# EAGLE design arm_femur_wLED_stemma (EAGLE 7.3.0)
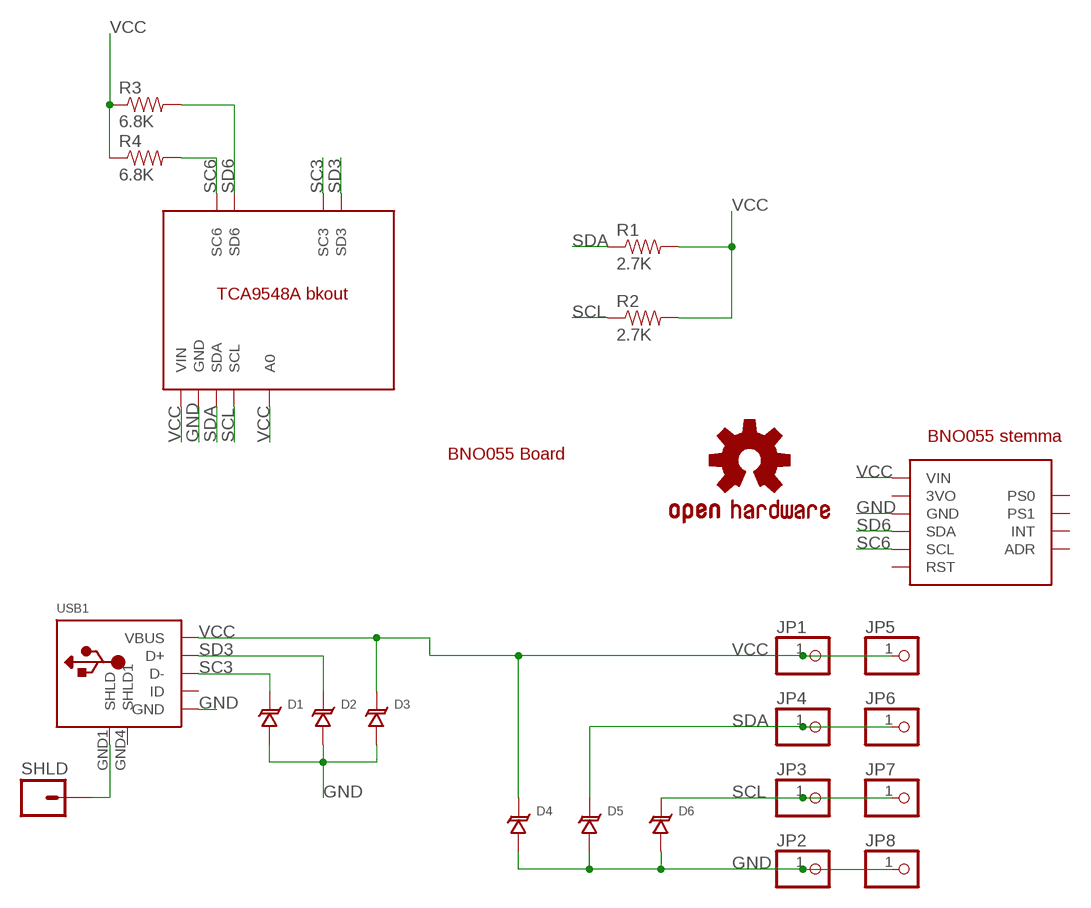
[diagram p0: schematic, sheet 1]

## Parts
D1  TVS_DIODE_SOD723  [SOD723]
D2  TVS_DIODE_SOD723  [SOD723]
D3  TVS_DIODE_SOD723  [SOD723]
D4  TVS_DIODE_SOD723  [SOD723]
D5  TVS_DIODE_SOD723  [SOD723]
D6  TVS_DIODE_SOD723  [SOD723]
JP1  PINHD-1X1CB  [1X01-CLEANBIG]
JP2  PINHD-1X1CB  [1X01-CLEANBIG]
JP3  PINHD-1X1CB  [1X01-CLEANBIG]
JP4  PINHD-1X1CB  [1X01-CLEANBIG]
JP5  PINHD-1X1CB  [1X01-CLEANBIG]
JP6  PINHD-1X1CB  [1X01-CLEANBIG]
JP7  PINHD-1X1CB  [1X01-CLEANBIG]
JP8  PINHD-1X1CB  [1X01-CLEANBIG]
LOGO1  OSHW-LOGOM  [OSHW-LOGO-M]
R1  2.7K  RESISTORAXIAL-0.3  [AXIAL-0.3]
R2  2.7K  RESISTORAXIAL-0.3  [AXIAL-0.3]
R3  6.8K  RESISTORAXIAL-0.3  [AXIAL-0.3]
R4  6.8K  RESISTORAXIAL-0.3  [AXIAL-0.3]
SHLD  M01PTH  [1X01]
U$2  TCA9548_ARM_FEMUR  [TCA9548_ARM_FEMUR]
U$3  BNO_055_STEMMA  [BNO_STEMMA]
USB1  USB  [USB-MINIB-THM-MOLEX_NOSLK]

## Nets
GND: D1.A D2.A D3.A D4.A D5.A D6.A JP2.1 JP8.1 U$2.GND U$3.GND USB1.GND
N$4: SHLD.1 USB1.GND1(SHLD)
SC3: D1.C U$2.SC3 USB1.D-
SC6: R4.P$2 U$2.SC6 U$3.SCL
SCL: D6.C JP3.1 JP7.1 R2.P$1 U$2.SCL
SD3: D2.C U$2.SD3 USB1.D+
SD6: R3.P$2 U$2.SD6 U$3.SDA
SDA: D5.C JP4.1 JP6.1 R1.P$1 U$2.SDA
VCC: D3.C D4.C JP1.1 JP5.1 R1.P$2 R2.P$2 R3.P$1 R4.P$1 U$2.A0 U$2.VIN U$3.VIN USB1.VBUS
Unconnected: U$3.3VO U$3.ADR U$3.INT U$3.PS0 U$3.PS1 U$3.RST USB1.GND4(SHLD1) USB1.ID

## Notes on the sheet
- BNO055 stemma
- BNO055 Board

## Library data of the parts
D1-D6 = little_fuse_tvs:TVS_DIODE_SOD723
JP1-JP8 = adafruit:PINHD-1X1: Pin header 1x1 for 0.1" spacing With round pins
LOGO1 = SparkFun-Aesthetics:OSHW-LOGO: Open Source Hardware Logo This logo indicates the piece of hardware it is found on incorporates a OSHW license and/or adheres to the definition of open source hardware found here: http://freedomdefined.org/OSHW
R1-R4 = SparkFun-Passives:RESISTOR: Resistor Basic schematic elements and footprints for 0603, 1206, and PTH resistors.
SHLD = SparkFun-Connectors:M01: Header 1 Standard 1-pin 0.1" header. Use with straight break away headers (SKU : PRT-00116), right angle break away headers (PRT-00553), swiss pins (PRT-00743), machine pins (PRT-00117), and female headers (PRT-00115). SMTSO-256-ET is a "flush mount" nut for a 4-40 screw. The older package used to be too tight, and did not allow it to sit properly thru the drill hit. The latest (0.165DIA) fits nice and snug.
U$2 = skeleton:TCA9548_ARM_FEMUR
U$3 = skeleton:BNO_055_STEMMA
USB1 = adafruit:USB: USB Connectors USBMINIB - Surface Mount Female Mini-B USB Connector 4UConnector: 06564 By microbuilder.eu Thru-hole RA Female Mini-B USB Connector 4UConnector: 18732 By ladyada.net

## Board
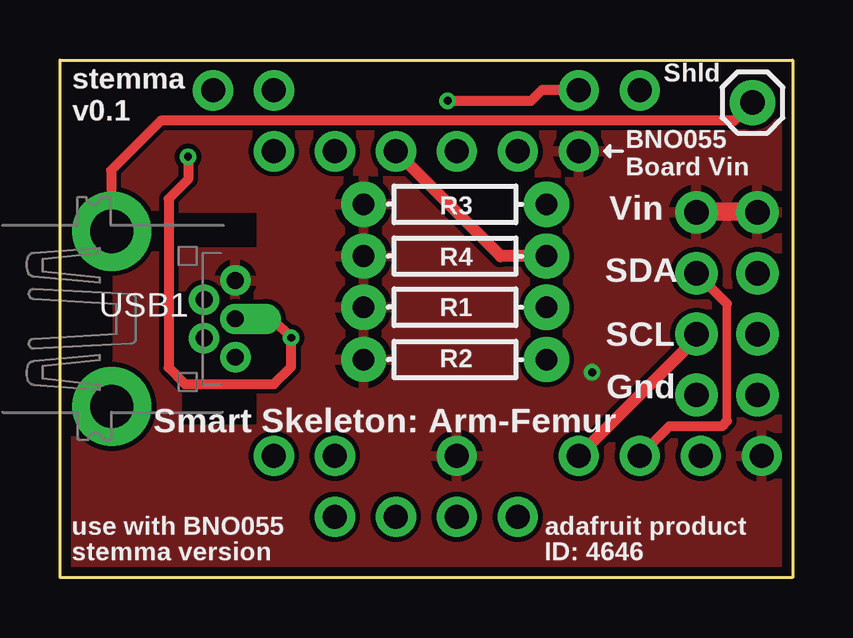
[diagram p1: board, top side]
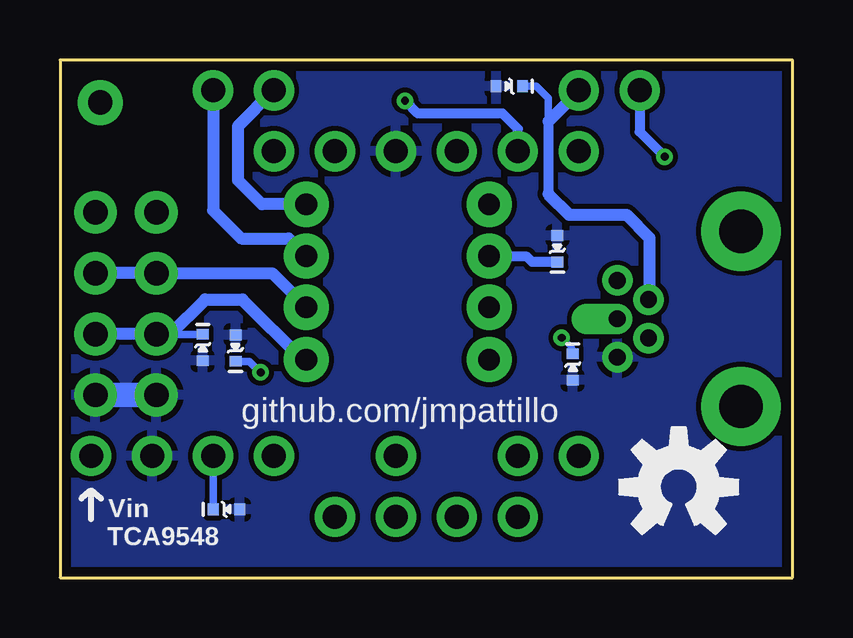
[diagram p2: board, bottom side, seen from below]

Size 30.53 x 21.59 mm. Coordinates in mm from the lower left corner, seen from the top.
Outline: 0,21.59 30.53,21.59 30.53,0 0,0 0,21.59
Copper layers (1*16): Top 0.0356mm / dielectric 1.5011mm / Bottom 0.0356mm
Design rules "LaenPCBOrder *": minimum track width 6mil, minimum drill 13mil, track to track 8mil, track to pad 8mil, pad to pad 8mil, via to via 6mil, smd to smd 6mil, copper to edge 15mil, drill to drill 6mil, minimum pad ring 7mil, minimum via ring 7mil, stop-mask expansion 0mil, vias tented up to drill 25mil, thermal gap 10mil

### Footprints (pad centres in the part's own frame; a part is rotated, then mirrored left to right if it is on the bottom)
SOD723 = smd 0.5 x 0.45: A 0,-0.55; C 0,0.55
1X01-CLEANBIG = drill 1.016 pad 1.778: 1 0,0
AXIAL-0.3 = drill 0.9 pad 1.88: P$1 -3.81,0; P$2 3.81,0
1X01 = drill 1.016 pad 1.88: 1 0,0
TCA9548_ARM_FEMUR = drill 1 pad 1.676: A0 -1.27,-7.62; GND -11.43,-7.62; SC3 6.35,7.62; SC6 -8.89,7.62; SCL -6.35,-7.62; SD3 8.89,7.62; SD6 -6.35,7.62; SDA -8.89,-7.62; VIN -13.97,-7.62
BNO_STEMMA = drill 1 pad 1.676: 3VO -3.81,-8.89; ADR -1.27,6.35; GND -1.27,-8.89; INT -3.81,6.35; PS0 1.27,6.35; PS1 3.81,6.35; RST 6.35,-8.89; SCL 1.27,-8.89; SDA 3.81,-8.89; VIN -6.35,-8.89
USB-MINIB-THM-MOLEX_NOSLK = drill 0.7 pad 1.27 offset: D+ 0,9.72 | drill 0.7 pad 1.27: D- -0.8,8.42; GND 1.6,9.72; ID 0.8,8.42; VBUS -1.6,9.72 | drill 1.8 pad 3.302: GND1 -3.65,4.57; GND4 3.65,4.57

### Placement (x,y rotation side)
D1  11.81,20.5 270 bottom
D2  9.17,8.79 0 bottom
D3  9.8,13.72 180 bottom
D4  23.22,9.58 180 bottom
D5  23.6,2.84 90 bottom
D6  24.59,9.6 0 bottom
JP1  29.06,15.24 0 top
JP2  29.06,7.62 0 top
JP3  29.06,10.16 0 top
JP4  29.06,12.7 0 top
JP5  26.52,15.24 0 top
JP6  26.52,12.7 0 top
JP7  26.52,10.16 0 top
JP8  26.52,7.62 0 top
LOGO1  4.75,3.78 0 bottom
R1  16.46,11.28 180 top
R2  16.46,9.09 180 top
R3  16.46,15.57 0 top
R4  16.46,13.41 0 top
SHLD  28.85,19.81 270 top
U$2  15.27,12.7 0 bottom
U$3  15.27,8.89 180 top
USB1  -2.41,10.79 270 top

### Tracks (layer width: path | path; a pad name or v marks a point on that pad's centre or on a via)
GND
  Bottom 1.016: JP8.1 JP2.1
  pour Bottom: 0.03,21.44 30.53,21.62 30.53,0.05 -0.03,-0.08
N$4
  Top 0.406: SHLD.1 28.09,19.05 4.19,19.05 2.13,16.99 2.13,14.47 USB1.GND1
NC1  (via drill 1 pad 1.68)
  other vias: 11.46,5.08
NC2  (via drill 1 pad 1.68)
  other vias: 8.92,5.08
SC3
  Bottom 0.305: 10.19,19.03 10.19,19.99 10.69,20.5 D1.C
  Bottom 0.406: 5.99,12.22 USB1.D- | 10.19,19.03 10.19,16
  Bottom 0.508: U$2.SC3 8.92,20.29 10.19,19.03 | 10.19,16 9.32,15.14 6.93,15.14 5.97,14.17 5.97,12.27 USB1.D-
SC6
  Top 0.508: R4.P$2 18.36,13.41 U$3.SCL
  Bottom 0.508: U$2.SC6 24.16,15.32 22.99,14.15 21.01,14.15 R4.P$2
SCL
  Top 0.508: U$2.SCL 26.52,9.98 JP7.1
  Bottom 0.305: D6.C JP7.1
  Bottom 0.508: JP3.1 JP7.1 25.93,10.16 24.49,11.61 22.94,11.61 20.42,9.09 R2.P$1
SD3  (via drill 0.33)
  Top 0.406: v5.33,17.55 5.33,16.61 4.52,15.8 4.52,8.76 5.21,8.08 8.92,8.08 9.63,8.79 v9.63,10.01 8.84,10.79 USB1.D+
  Bottom 0.254: D2.C 9.17,9.55 v9.63,10.01
  Bottom 0.406: U$2.SD3 6.38,18.59 v5.33,17.55
SD6  (via drill 0.33)
  Top 0.406: v16.15,19.89 19.63,19.89 20.09,20.35 21.59,20.35 U$2.SD6
  Bottom 0.406: U$3.SDA 11.46,18.72 12.09,19.36 15.62,19.36 v16.15,19.89
  Bottom 0.508: U$2.SD6 23.11,18.82 23.11,16.56 22.12,15.57 R3.P$2
SDA
  Top 0.356: 27.79,6.53 27.79,11.43
  Top 0.406: U$2.SDA 25.4,6.32 27.58,6.32 27.79,6.53 | 27.79,11.43 JP6.1
  Bottom 0.305: U$2.SDA 24.16,3.23 D5.C
  Bottom 0.508: JP4.1 JP6.1 21.69,12.7 R1.P$1
VCC  (via drill 0.33)
  Top 0.762: 26.52,15.26 28.98,15.26
  Bottom 0.305: D4.C 22.64,9.03 v22.17,8.56
  Bottom 0.406: D3.C 10.85,13.17 11.07,13.39 12.62,13.39 R4.P$1
  pour Top: 0.03,21.69 30.48,21.59 30.51,0 -0.05,-0.03

### Text on the board
tPlace: stemma / v0.1 | Smart Skeleton: Arm-Femur | use with BNO055 / stemma version | adafruit product / ID: 4646
tNames: Shld | BNO055 / Board Vin | Vin | SDA | USB1 | SCL | Gnd
bNames: github.com/jmpattillo | Vin | TCA9548